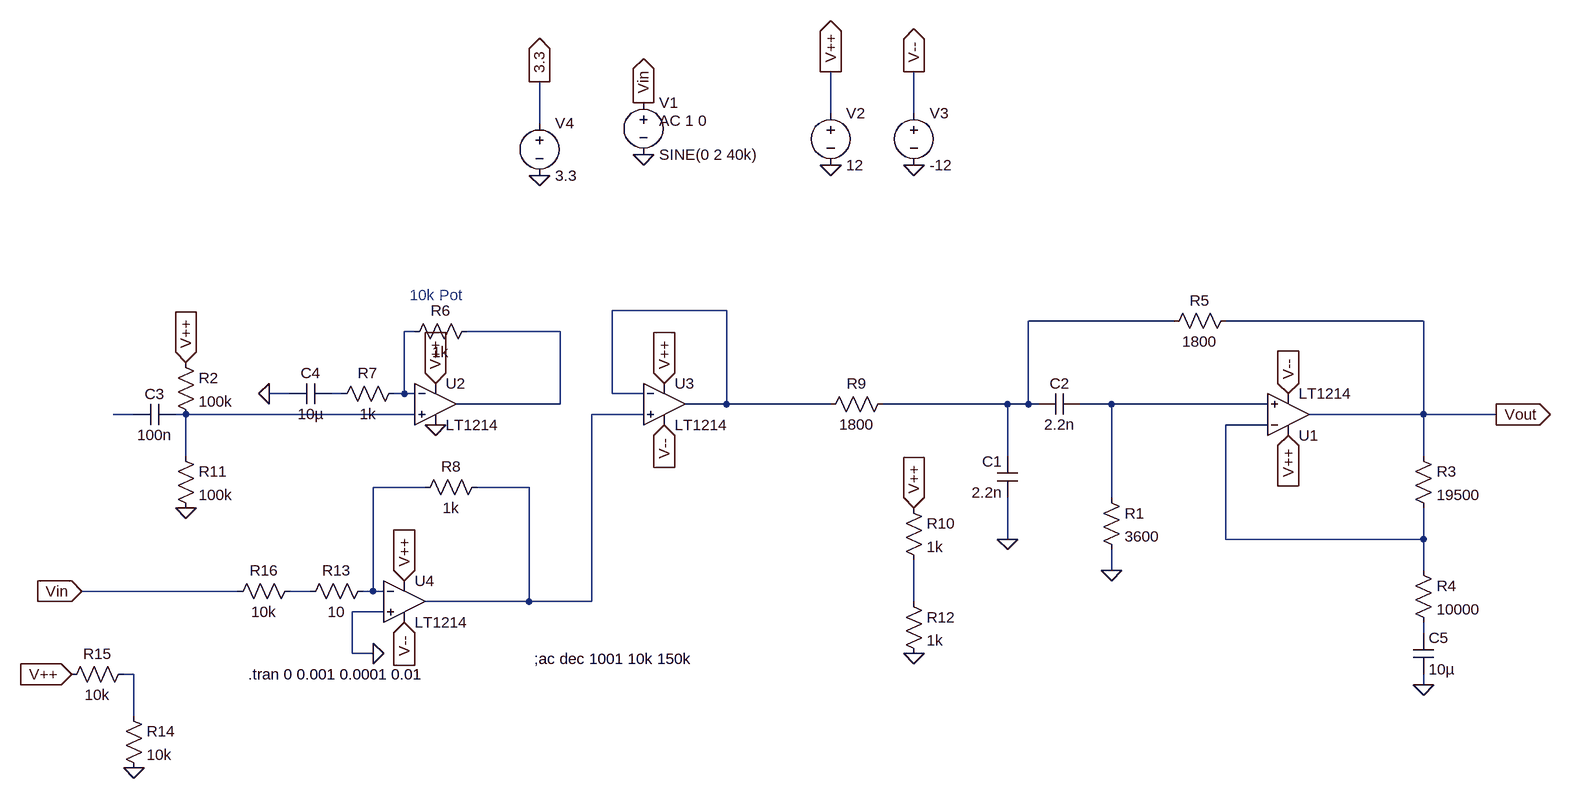
[diagram p0: schematic workingSallenBiasUpdated.asc]
workingSallenBiasUpdated.asc, the LTspice schematic file:
Version 4
SHEET 1 1120 708
WIRE -16 -320 -16 -384
WIRE 112 -320 112 -384
WIRE -464 -304 -464 -368
WIRE -176 -16 -352 -16
WIRE 512 0 288 0
WIRE 896 0 592 0
WIRE -656 16 -672 16
WIRE -432 16 -576 16
WIRE -848 112 -880 112
WIRE -768 112 -784 112
WIRE -672 112 -672 16
WIRE -672 112 -688 112
WIRE -656 112 -672 112
WIRE -352 112 -352 -16
WIRE -304 112 -352 112
WIRE -432 128 -432 16
WIRE -432 128 -592 128
WIRE -176 128 -176 -16
WIRE -176 128 -240 128
WIRE -16 128 -176 128
WIRE 256 128 64 128
WIRE 288 128 288 0
WIRE 288 128 256 128
WIRE 304 128 288 128
WIRE 416 128 368 128
WIRE 656 128 416 128
WIRE -1088 144 -1120 144
WIRE -1008 144 -1024 144
WIRE -656 144 -1008 144
WIRE -304 144 -384 144
WIRE 896 144 896 0
WIRE 896 144 720 144
WIRE 1008 144 896 144
WIRE 656 160 592 160
WIRE -1008 208 -1008 144
WIRE 256 208 256 128
WIRE 896 208 896 144
WIRE -640 256 -720 256
WIRE -480 256 -560 256
WIRE 416 272 416 128
WIRE 256 336 256 272
WIRE 592 336 592 160
WIRE 896 336 896 288
WIRE 896 336 592 336
WIRE 416 384 416 352
WIRE 896 384 896 336
WIRE -928 416 -1168 416
WIRE -816 416 -848 416
WIRE -720 416 -720 256
WIRE -720 416 -736 416
WIRE -704 416 -720 416
WIRE -480 432 -480 256
WIRE -480 432 -640 432
WIRE -384 432 -384 144
WIRE -384 432 -480 432
WIRE 112 432 112 368
WIRE -704 448 -752 448
WIRE 896 480 896 464
WIRE -752 512 -752 448
WIRE -720 512 -752 512
WIRE -1088 544 -1104 544
WIRE 896 560 896 544
WIRE -1088 608 -1088 544
FLAG 256 336 0
FLAG -16 -240 0
FLAG 112 -240 0
FLAG 1008 144 Vout
IOPIN 1008 144 Out
FLAG -16 -384 V++
IOPIN -16 -384 Out
FLAG 112 -384 V--
IOPIN 112 -384 Out
FLAG -304 -256 0
FLAG -304 -336 Vin
IOPIN -304 -336 Out
FLAG -880 112 0
FLAG -624 96 V++
IOPIN -624 96 In
FLAG -272 96 V++
IOPIN -272 96 In
FLAG -1008 288 0
FLAG -624 160 0
FLAG -464 -224 0
FLAG -464 -368 3.3
IOPIN -464 -368 Out
FLAG -1008 64 V++
IOPIN -1008 64 In
FLAG 688 176 V++
IOPIN 688 176 In
FLAG 896 560 0
FLAG 112 288 V++
IOPIN 112 288 In
FLAG 112 512 0
FLAG -672 400 V++
IOPIN -672 400 In
FLAG -1168 416 Vin
IOPIN -1168 416 In
FLAG -1088 688 0
FLAG -1184 544 V++
IOPIN -1184 544 In
FLAG -720 512 0
FLAG -672 464 V--
IOPIN -672 464 In
FLAG -272 160 V--
IOPIN -272 160 In
FLAG 688 112 V--
IOPIN 688 112 In
FLAG 416 384 0
SYMBOL cap 272 272 R180
WINDOW 0 24 56 Left 2
WINDOW 3 24 8 Left 2
SYMATTR InstName C1
SYMATTR Value 2.2n
SYMBOL cap 368 112 R90
WINDOW 0 0 32 VBottom 2
WINDOW 3 32 32 VTop 2
SYMATTR InstName C2
SYMATTR Value 2.2n
SYMBOL voltage -16 -336 R0
WINDOW 123 0 0 Left 0
WINDOW 39 0 0 Left 0
SYMATTR InstName V2
SYMATTR Value 12
SYMBOL voltage 112 -336 R0
WINDOW 123 0 0 Left 0
WINDOW 39 0 0 Left 0
SYMATTR InstName V3
SYMATTR Value -12
SYMBOL res 880 192 R0
SYMATTR InstName R3
SYMATTR Value 19500
SYMBOL res 880 368 R0
SYMATTR InstName R4
SYMATTR Value 10000
SYMBOL res 608 -16 R90
WINDOW 0 0 56 VBottom 2
WINDOW 3 32 56 VTop 2
SYMATTR InstName R5
SYMATTR Value 1800
SYMBOL voltage -304 -352 R0
WINDOW 123 24 44 Left 2
WINDOW 39 0 0 Left 0
SYMATTR Value2 AC 1 0
SYMATTR InstName V1
SYMATTR Value SINE(0 2 40k)
SYMBOL OpAmps\\LT1214 688 208 M180
SYMATTR InstName U1
SYMBOL Opamps\\LT1214 -624 64 R0
SYMATTR InstName U2
SYMBOL res -560 0 R90
WINDOW 0 0 56 VBottom 2
WINDOW 3 32 56 VTop 2
SYMATTR InstName R6
SYMATTR Value 1k
SYMBOL res -672 96 R90
WINDOW 0 0 56 VBottom 2
WINDOW 3 32 56 VTop 2
SYMATTR InstName R7
SYMATTR Value 1k
SYMBOL res 80 112 R90
WINDOW 0 0 56 VBottom 2
WINDOW 3 32 56 VTop 2
SYMATTR InstName R9
SYMATTR Value 1800
SYMBOL Opamps\\LT1214 -272 64 R0
SYMATTR InstName U3
SYMBOL res -1024 192 R0
SYMATTR InstName R11
SYMATTR Value 100k
SYMBOL res 400 256 R0
SYMATTR InstName R1
SYMATTR Value 3600
SYMBOL res -1024 48 R0
SYMATTR InstName R2
SYMATTR Value 100k
SYMBOL voltage -464 -320 R0
WINDOW 123 0 0 Left 0
WINDOW 39 0 0 Left 0
SYMATTR InstName V4
SYMATTR Value 3.3
SYMBOL cap -784 96 R90
WINDOW 0 0 32 VBottom 2
WINDOW 3 32 32 VTop 2
SYMATTR InstName C4
SYMATTR Value 10µ
SYMBOL res 96 272 R0
SYMATTR InstName R10
SYMATTR Value 1k
SYMBOL cap 880 480 R0
SYMATTR InstName C5
SYMATTR Value 10µ
SYMBOL res 96 416 R0
SYMATTR InstName R12
SYMATTR Value 1k
SYMBOL cap -1024 128 R90
WINDOW 0 0 32 VBottom 2
WINDOW 3 32 32 VTop 2
SYMATTR InstName C3
SYMATTR Value 100n
SYMBOL Opamps\\LT1214 -672 368 R0
SYMATTR InstName U4
SYMBOL res -544 240 R90
WINDOW 0 0 56 VBottom 2
WINDOW 3 32 56 VTop 2
SYMATTR InstName R8
SYMATTR Value 1k
SYMBOL res -720 400 R90
WINDOW 0 0 56 VBottom 2
WINDOW 3 32 56 VTop 2
SYMATTR InstName R13
SYMATTR Value 10
SYMBOL res -1104 592 R0
SYMATTR InstName R14
SYMATTR Value 10k
SYMBOL res -1088 528 R90
WINDOW 0 0 56 VBottom 2
WINDOW 3 32 56 VTop 2
SYMATTR InstName R15
SYMATTR Value 10k
SYMBOL res -832 400 R90
WINDOW 0 0 56 VBottom 2
WINDOW 3 32 56 VTop 2
SYMATTR InstName R16
SYMATTR Value 10k
TEXT -472 520 Left 2 !;ac dec 1001 10k 150k
TEXT -664 -40 Left 2 ;10k Pot
TEXT -912 544 Left 2 !.tran 0 0.001 0.0001 0.01

The netlist it stands for:
* workingSallenBiasUpdated.asc
C1 0 N002 2.2n
C2 N006 N002 2.2n
V2 V++ 0 12
V3 V-- 0 -12
R3 Vout N010 19500
R4 N010 N014 10000
R5 Vout N002 1800
V1 Vin 0 SINE(0 2 40k) AC 1 0
XU1 N006 N010 V++ V-- Vout LT1213  ; LT1214, pins In+ In- V+ V- OUT
XU2 N008 N003 V++ 0 N004 LT1213  ; LT1214, pins In+ In- V+ V- OUT
R6 N004 N003 1k
R7 N003 N005 1k
R9 N002 N001 1800
XU3 N009 N001 V++ V-- N001 LT1213  ; LT1214, pins In+ In- V+ V- OUT
R11 N008 0 100k
R1 N006 0 3600
R2 V++ N008 100k
V4 3.3 0 3.3
C4 N005 0 10µ
R10 V++ N013 1k
C5 N014 0 10µ
R12 N013 0 1k
C3 N008 N007 100n
XU4 0 N011 V++ V-- N009 LT1213  ; LT1214, pins In+ In- V+ V- OUT
R8 N009 N011 1k
R13 N011 N012 10
R14 N015 0 10k
R15 N015 V++ 10k
R16 N012 Vin 10k
;ac dec 1001 10k 150k
* 10k Pot
.tran 0 0.001 0.0001 0.01
.lib LTC.lib
.backanno
.end